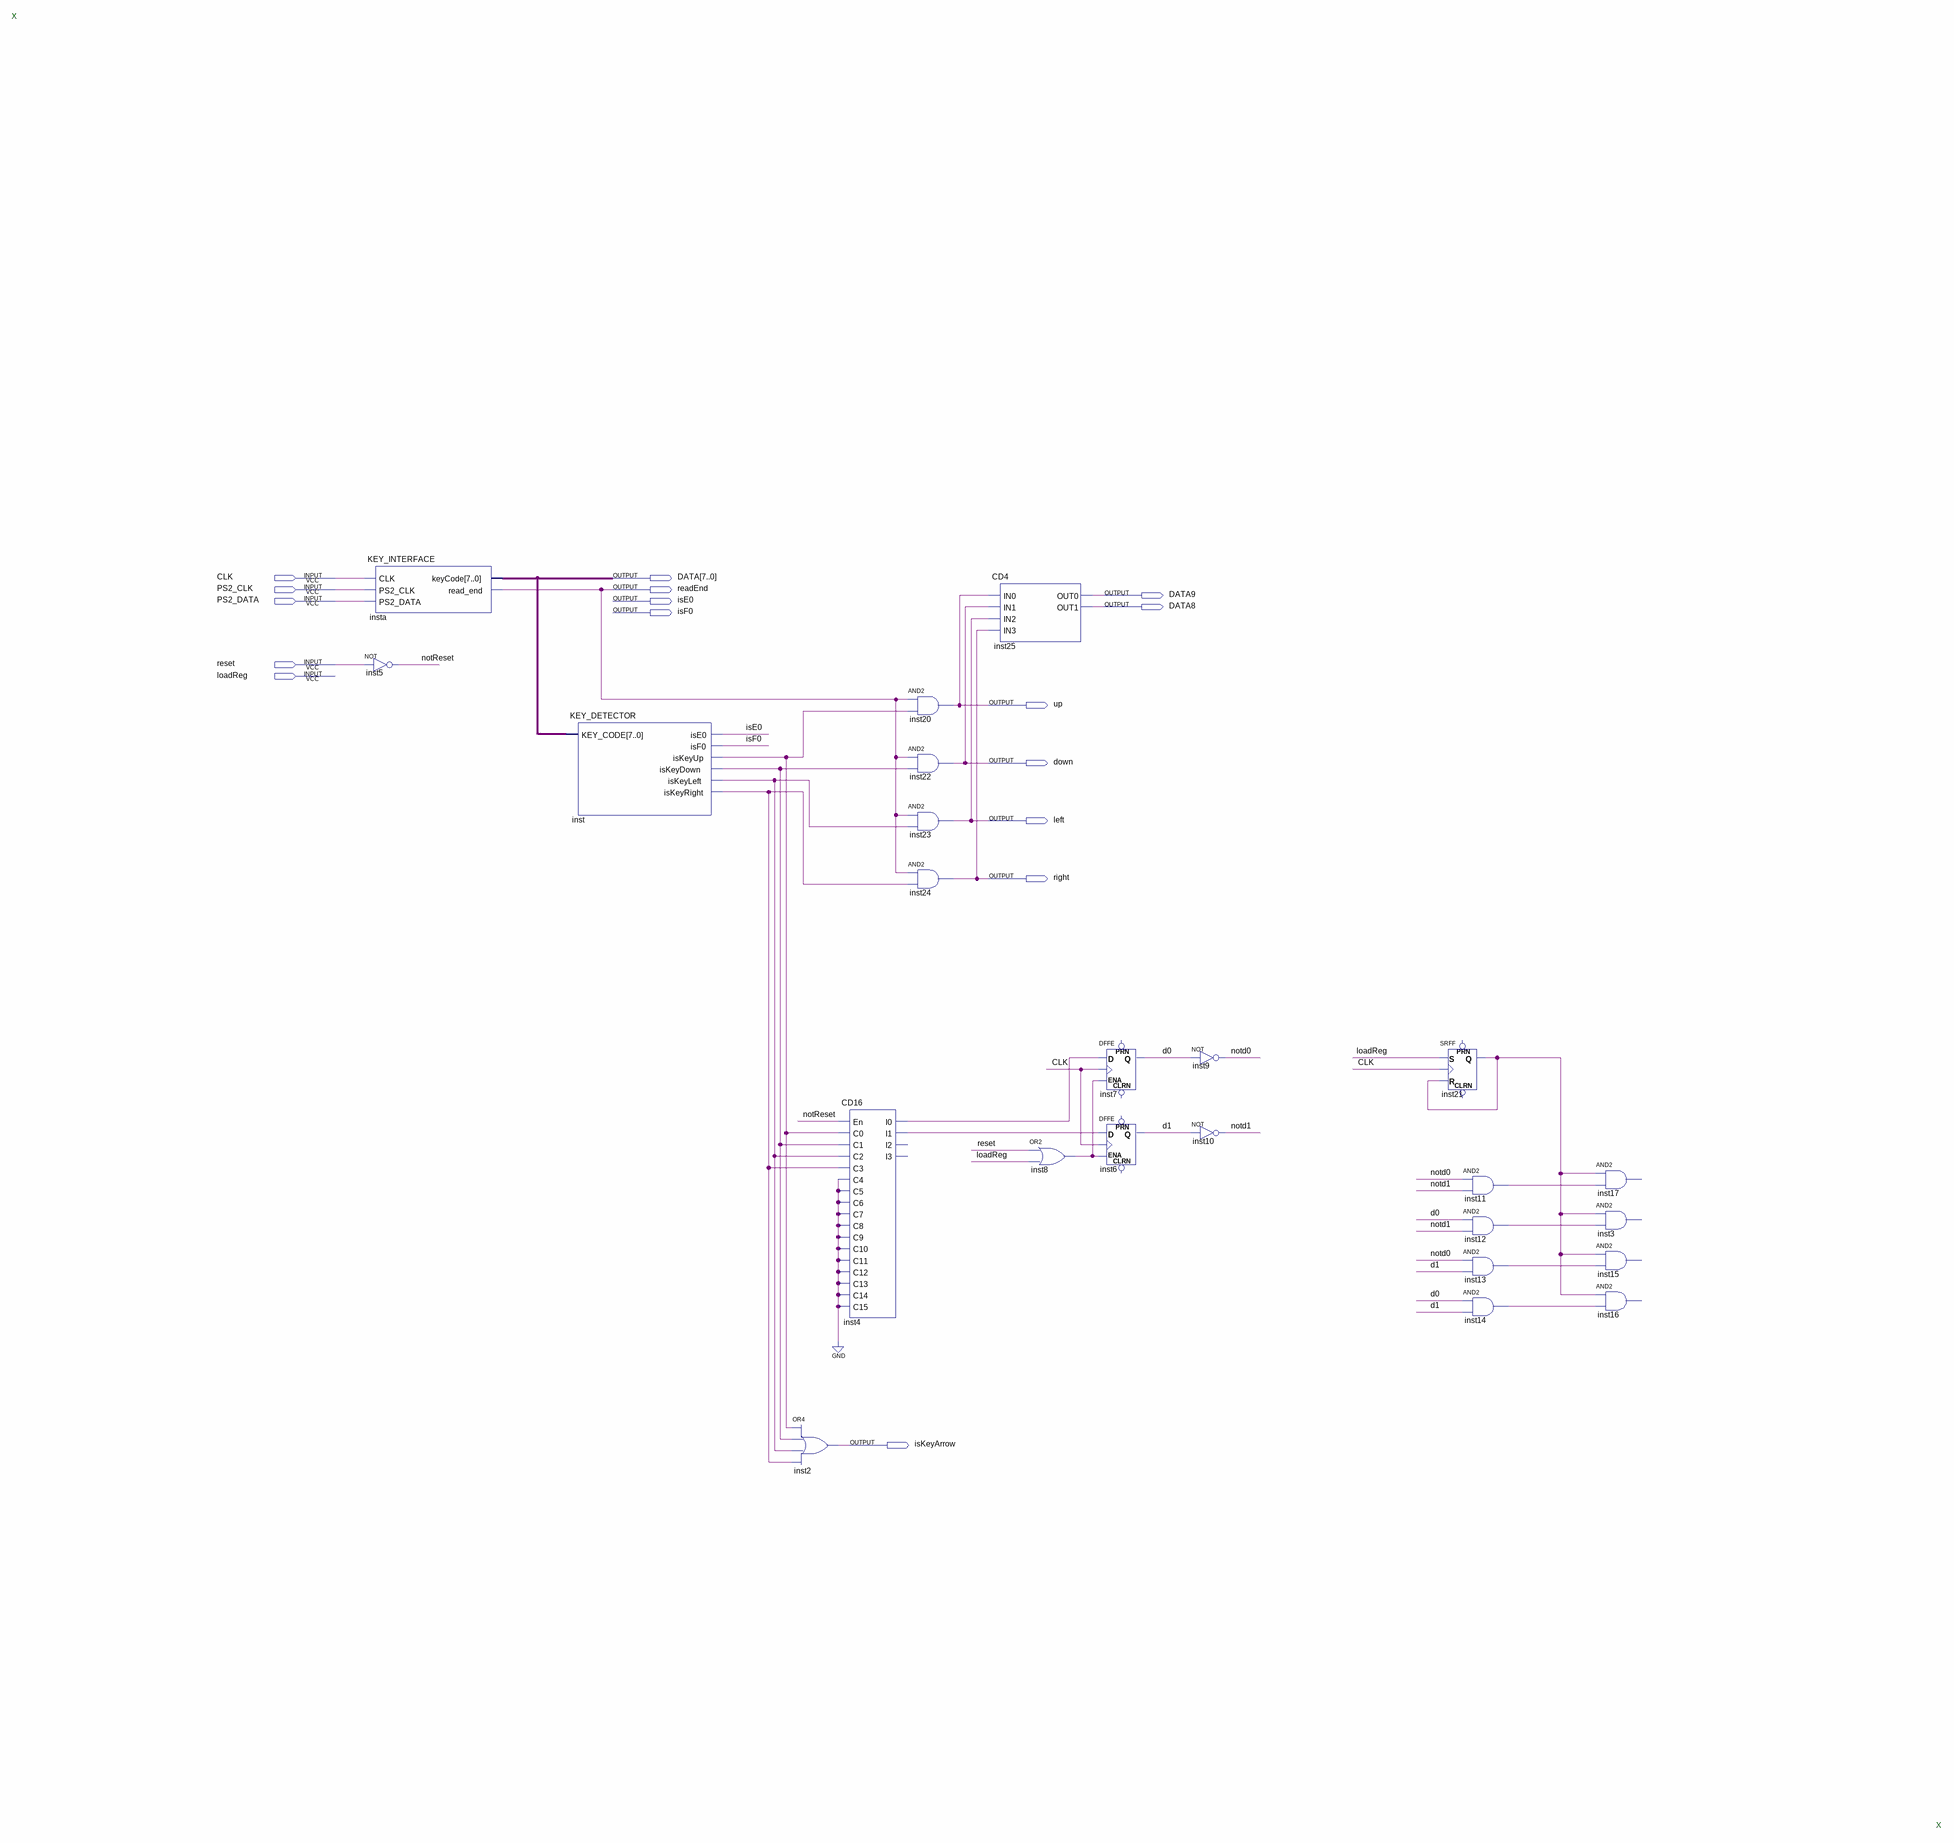
[diagram p0: schematic sheet]
// Quartus schematic KEY_DECODER_OP.bdf as structural Verilog: 24 symbols, 16 pins
module KEY_DECODER_OP (
  input  CLK,
  input  PS2_CLK,
  input  PS2_DATA,
  input  reset,
  input  loadReg,
  output [7:0] DATA,
  output readEnd,
  output DATA9,
  output isE0,
  output DATA8,
  output isF0,
  output up,
  output down,
  output left,
  output right,
  output isKeyArrow
);

  wire d0, d1, inst4_i0, inst4_i1, inst8_out, inst11_out, inst12_out, inst13_out, inst14_out, inst21_q,
       inst_iskeydown, inst_iskeyleft, inst_iskeyright, inst_iskeyup, notd0, notd1, notReset;

  KEY_INTERFACE insta (.CLK(CLK), .PS2_CLK(PS2_CLK), .PS2_DATA(PS2_DATA), .keyCode(DATA), .read_end(readEnd));
  not inst5 (notReset, reset);
  KEY_DETECTOR inst (
    .KEY_CODE(DATA), .isE0(isE0), .isF0(isF0), .isKeyUp(inst_iskeyup), .isKeyDown(inst_iskeydown),
    .isKeyLeft(inst_iskeyleft), .isKeyRight(inst_iskeyright));
  or inst2 (isKeyArrow, inst_iskeyup, inst_iskeydown, inst_iskeyleft, inst_iskeyright);
  CD16 inst4 (
    .En(notReset), .C0(inst_iskeyup), .C1(inst_iskeydown), .C2(inst_iskeyleft), .C3(inst_iskeyright),
    .C4(1'b0), .C5(1'b0), .C6(1'b0), .C7(1'b0), .C8(1'b0), .C9(1'b0), .C10(1'b0), .C11(1'b0), .C12(1'b0),
    .C13(1'b0), .C14(1'b0), .C15(1'b0), .I0(inst4_i0), .I1(inst4_i1));  // open: I2, I3
  and inst20 (up, readEnd, inst_iskeyup);
  and inst22 (down, readEnd, inst_iskeydown);
  and inst23 (left, readEnd, inst_iskeyleft);
  and inst24 (right, readEnd, inst_iskeyright);
  CD4 inst25 (.IN0(up), .IN1(down), .IN2(left), .IN3(right), .OUT0(DATA9), .OUT1(DATA8));
  or inst8 (inst8_out, reset, loadReg);
  DFFE inst7 (.D(inst4_i0), .CLK(CLK), .ENA(inst8_out), .Q(d0));  // open: PRN, CLRN
  DFFE inst6 (.D(inst4_i1), .CLK(CLK), .ENA(inst8_out), .Q(d1));  // open: PRN, CLRN
  not inst9 (notd0, d0);
  not inst10 (notd1, d1);
  SRFF inst21 (.S(loadReg), .R(inst21_q), .CLK(CLK), .Q(inst21_q));  // open: PRN, CLRN
  and inst11 (inst11_out, notd0, notd1);
  and inst12 (inst12_out, d0, notd1);
  and inst13 (inst13_out, notd0, d1);
  and inst14 (inst14_out, d0, d1);
  // AND2 inst17 has open pins: IN1=inst21_q, IN2=inst11_out, OUT=open
  // AND2 inst3 has open pins: IN1=inst21_q, IN2=inst12_out, OUT=open
  // AND2 inst15 has open pins: IN1=inst21_q, IN2=inst13_out, OUT=open
  // AND2 inst16 has open pins: IN1=inst21_q, IN2=inst14_out, OUT=open

  // Notes on the sheet:
  //   X
  //   X
endmodule
